# Altium project MB1292.PrjPcb (part 3 of 3)

## Sheet LEDs_Buttons.SchDoc: LEDs, touchkey and push-buttons
size A4; Date: Not used; ApprovedBy: Not used; CheckedBy: Not used; Author: Not used; CompanyName: STMicroelectronics; DrawnBy: Not used; Engineer: Not used; Organization: Not used; Address1: Not used; Address2: Not used; Address3: Not used; Address4: Not used; DocumentNumber: Not used; Revision: Not used; SheetNumber: 5; SheetTotal: 8; CurrentTime: Not used; CurrentDate: Not used; Time: Not used; DocumentFullPathAndName: Not used; DocumentName: Not used; ModifiedDate: Not used; ImagePath: Not used; ProjectName: Not used; Application_BuildNumber: Not used
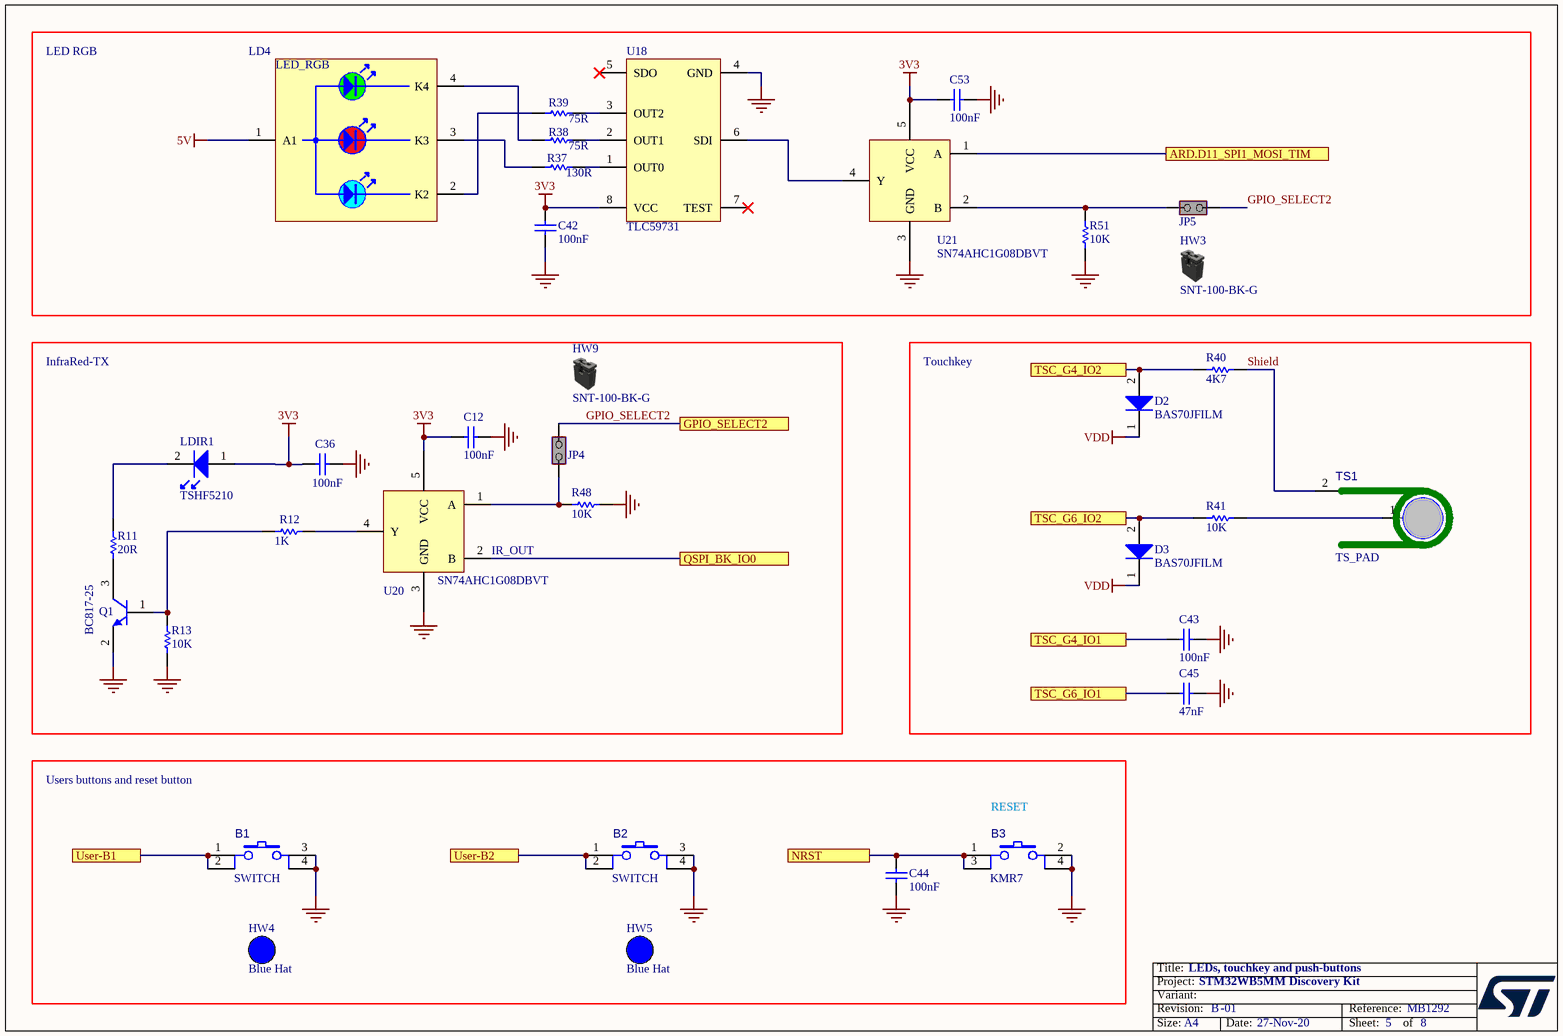
[diagram p7: LEDs_Buttons.SchDoc]

### Parts
B1  value SWITCH  [SWI_WEALTHMETAL_TD-0341_4P_BLUE]  (hidden comment: SW-PUSH-CMS)
B2  value SWITCH  [SWI_WEALTHMETAL_TD-0341_4P_BLUE]  (hidden comment: SW-PUSH-CMS)
B3  value KMR7  [SWI_C&K_KMR721NG-LFS]  (hidden comment: SW-PUSH-CMS_KMR_NG)
C12  value 100nF  [C0402]  (hidden comment: Capacitor)
C36  value 100nF  [C0402]  (hidden comment: Capacitor)
C42  value 100nF  [C0402]  (hidden comment: Capacitor)
C43  value 100nF  [C1206_H1P6]  (hidden comment: Capacitor)
C44  value 100nF  [C0402]  (hidden comment: Capacitor)
C45  value 47nF  [C0805_KEMET_IPC-7351_DENSITY-LEVEL-B_H1P25]  (hidden comment: Capacitor)
C53  value 100nF  [C0402]  (hidden comment: Capacitor)
D2  value BAS70JFILM  [DIO_SOD323_1K_2A]  (hidden comment: DIODE_1K_2A)
D3  value BAS70JFILM  [DIO_SOD323_1K_2A]  (hidden comment: DIODE_1K_2A)
HW3  value SNT-100-BK-G  (hidden comment: Shunt Black 2.54mm)  (mechanical)
HW4  value Blue Hat  (hidden comment: BUTTON_HAT_BLUE)  (mechanical)
HW5  value Blue Hat  (hidden comment: BUTTON_HAT_BLUE)  (mechanical)
HW9  value SNT-100-BK-G  (hidden comment: Shunt Black 2.54mm)  (mechanical)
JP4  Jumper_Header 2x1 Fitted  [CON_SAMTEC_TSW-102-07-G-S]  (value not drawn)
JP5  Jumper_Header 2x1 Fitted  [CON_SAMTEC_TSW-102-07-G-S]  (value not drawn)
LD4  LED_RGB  [LED_TRI-RGB_WURTH_150141M173100]
LDIR1  TSHF5210  [LED_INFRARED_VISHAY_TSHF5210_IN-MODE-SMT_BOARD-EDGE_1A2K_P254]
Q1  value BC817-25  [NPN_SOT23]  (hidden comment: 9013-SOT23)
R11  value 20R  [R0603]  (hidden comment: Resistor)
R12  value 1K  [R0402]  (hidden comment: Resistor)
R13  value 10K  [R0402]  (hidden comment: Resistor)
R37  value 130R  [R0603]  (hidden comment: Resistor)
R38  value 75R  [R0603]  (hidden comment: Resistor)
R39  value 75R  [R0603]  (hidden comment: Resistor)
R40  value 4K7  [R0603]  (hidden comment: Resistor)
R41  value 10K  [R0603]  (hidden comment: Resistor)
R48  value 10K  [R0402]  (hidden comment: Resistor)
R51  value 10K  [R0402]  (hidden comment: Resistor)
TS1  TS_PAD  [TSB_TOUCH-SENSING-BUTTON_TS-PAD-10_SHIELD-14_2]  (no BOM)
U18  TLC59731  [ICC_SOIC8_3P91X4P90_P127_H1P75]
U20  SN74AHC1G08DBVT  [ICC_SOT23-5L_H1P45]
U21  SN74AHC1G08DBVT  [ICC_SOT23-5L_H1P45]

### Blocks framed on the sheet
LED RGB: C42 C53 HW3 JP5 LD4 R37-R39 R51 U18 U21
Touchkey: C43 C45 D2 D3 R40 R41 TS1

### Ports
ARD.D11_SPI1_MOSI_TIM, GPIO_SELECT2, NRST, QSPI_BK_IO0, TSC_G4_IO1, TSC_G4_IO2, TSC_G6_IO1, TSC_G6_IO2, User-B1, User-B2

### Nets
3V3: C12.2 C36.2 C42.2 C53.2 LDIR1.1(A) U18.8(VCC) U20.5(VCC) U21.5(VCC)
5V: LD4.1(A1)
GND: B1.3 B1.4 B2.3 B2.4 B3.2 B3.4 C12.1 C36.1 C42.1 C43.1 C44.2 C45.1 C53.1 Q1.2(E) R13.1 R48.2 R51.1 U18.4(GND) U20.3(GND) U21.3(GND)
VDD: D2.1(K) D3.1(K)
ARD.D11_SPI1_MOSI_TIM: U21.1(A) ; port ARD.D11_SPI1_MOSI_TIM
GPIO_SELECT2: JP4.1(COMMON) JP5.2(NO) ; port GPIO_SELECT2
NRST: B3.1 B3.3 C44.1 ; port NRST
QSPI_BK_IO0: U20.2(B) ; port QSPI_BK_IO0
Shield: R40.2 TS1.2(SHIELD)
TSC_G4_IO1: C43.2 ; port TSC_G4_IO1
TSC_G4_IO2: D2.2(A) R40.1 ; port TSC_G4_IO2
TSC_G6_IO1: C45.2 ; port TSC_G6_IO1
TSC_G6_IO2: D3.2(A) R41.1 ; port TSC_G6_IO2
User-B1: B1.1 B1.2 ; port User-B1
User-B2: B2.1 B2.2 ; port User-B2
NetJP4_2: JP4.2(NO) R48.1 U20.1(A)
NetJP5_1: JP5.1(COMMON) R51.2 U21.2(B)
NetLD4_2: LD4.2(K2) R39.1
NetLD4_3: LD4.3(K3) R37.1
NetLD4_4: LD4.4(K4) R38.1
NetLDIR1_2: LDIR1.2(K) R11.1
NetQ1_1: Q1.1(B) R12.1 R13.2
NetQ1_3: Q1.3(C) R11.2
NetR12_2: R12.2 U20.4(Y)
NetR37_2: R37.2 U18.1(OUT0)
NetR38_2: R38.2 U18.2(OUT1)
NetR39_2: R39.2 U18.3(OUT2)
NetR41_2: R41.2 TS1.1(TKEY)
NetU18_6: U18.6(SDI) U21.4(Y)

Not connected (* = marked no-connect by the designer): U18 5(SDO)* 7(TEST)*

### Notes on the sheet
- InfraRed-TX
- (near U20) IR_OUT
- Users buttons and reset button
- (near B3) RESET
- Title:
- Project:
- Size:
- Revision:
- Variant:
- A4
- -
- Date:
- Reference:
- Sheet:
- of

### Library data of the parts
B1 B2 = MCD-00002: Non-Open Push-Button 0.1A 24V; Part_Type: Misc; Manufacturer_Part_Number: TD-0341; Manufacturer: WEALTHMETAL; Part_Preference: Recommended; Internal_Part_Number: MCD-00002; Status: Released; ComponentLink1URL: http://tunmcdsvn.tun.st.com/Component_Datasheet_Library/Trunk/Misc/Wealthmetal_Tact-Switch_TD0341
B3 = MCD-01510: Microminiature SMT Top, 2N, N.O., IP67; Part_Type: Misc; Manufacturer_Part_Number: KMR721NG LFS; Manufacturer: C&K; Part_Preference: Recommended; Internal_Part_Number: MCD-01510; Status: New; Package: KMR7; ComponentLink1URL: http://tunmcdsvn.tun.st.com/Component_Datasheet_Library/Trunk/Misc/C&K_KMR7/kmr7.pdf
C12 C36 C42 C44 C53 = MCD-00006: Capacitor, MLCC, 100nF, 16V, X7R, +/-10%, 0402, T=0.5mm; Manufacturer_Part_Number: CC0402KRX7R7BB104; Manufacturer: YAGEO; Alternate_Manufacturer_Part_Number: GCM155R71C104KA55D; Alternate_Manufacturer: MURATA; Part_Preference: Recommended; Order_Code_RS: 616-9701; Internal_Part_Number: MCD-00006; Status: Released; Part_Type: Capacitor; Package: C0402; ComponentLink1URL: http://tunmcdsvn.tun.st.com/Component_Datasheet_Library/Trunk/Capacitors/Yageo_Multilayer_Capacitor_X7R_series_100pF_to_22uF; Order_Code_Digikey: 311-1338-1-ND; Order_Code_Farnell: 9402047
C43 = MCD-02039: Capacitor, COG, 100nF, 25V , 1206, 5%; Manufacturer_Part_Number: C1206X104J3GACTU; Manufacturer: KEMET; Part_Preference: Recommended; Internal_Part_Number: MCD-02039; Status: Released; Part_Type: Capacitor; Package: C1206; ComponentLink1URL: http://tunmcdsvn.tun.st.com/Component_Datasheet_Library/Trunk/Capacitors/KEMET_Capacitor_C0G-series; Order_Code_Digikey: N/A; Order_Code_Farnell: 2760643; Order_Code_RS: N/A; Alternate_Manufacturer: N/A; Alternate_Manufacturer_Part_Number: N/A
C45 = MCD-02040: Capacitor, COG, 47nF, 25V , 0805, 5%; Manufacturer_Part_Number: C0805C473J3GACTU; Manufacturer: KEMET; Part_Preference: Recommended; Internal_Part_Number: MCD-02040; Status: Released; Part_Type: Capacitor; Package: C0805; ComponentLink1URL: http://tunmcdsvn.tun.st.com/Component_Datasheet_Library/Trunk/Capacitors/KEMET_Capacitor_C0G-series; Order_Code_Digikey: N/A; Order_Code_Farnell: 1535570; Order_Code_RS: N/A; Alternate_Manufacturer: N/A; Alternate_Manufacturer_Part_Number: N/A
D2 D3 = MCD-01880: ultrafast and RF switching diode, VF = 0.41 V @ IF = 1mA; VR = 70V;; Manufacturer: STMICROELECTRONICS; BMS_Part_Number: 9151076; Part_Preference: Recommended; Manufacturer_HQ_COO: EU; Order_Code_RS: 714-0486; Component_Country_Of_Origin: China; Internal_Part_Number: MCD-01880; Status: Released; Part_Type: Diode; Manufacturer_Part_Number: BAS70JFILM; Package: SOD-323; ComponentLink1URL: http://tunmcdsvn.tun.st.com/Component_Datasheet_Library/Trunk/Diodes/STM_SCHOTTKY_BAS70JFILM; Alternate_Manufacturer: N/A; Alternate_Manufacturer_Part_Number: N/A; Order_Code_Digikey: 497-6652-1-ND; Order_Code_Farnell: 9801413
HW3 HW9 = MCD-00043: SHUNT 2.54mm BLACK; Part_Type: Misc; Manufacturer: SAMTEC; Alternate_Manufacturer_Part_Number: 316102S111A; Alternate_Manufacturer: JIUBABA; Part_Preference: Recommended; Internal_Part_Number: MCD-00043; Status: Released; Manufacturer_Part_Number: SNT-100-BK-G; ComponentLink1URL: http://tunmcdsvn.tun.st.com/Component_Datasheet_Library/Trunk/Connectors/Samtec_Shunt_Jumper_SNT100
HW4 HW5 = MCD-02136: switch hat,blue,KTSC-62B; Part_Type: Misc; Manufacturer_Part_Number: AKTSC62B; Manufacturer: APEM; Part_Preference: Recommended; Order_Code_RS: 378-6779; Internal_Part_Number: MCD-02136; Status: Checked; Alternate_Manufacturer_Part_Number: N/A; Alternate_Manufacturer: N/A; ComponentLink1URL: http://tunmcdsvn.tun.st.com/Component_Datasheet_Library/Trunk/Mechanical/APEM_BLUEHAT_KTSC62; Order_Code_Digikey: AKTSC62B-ND; Order_Code_Farnell: N/A
JP4 JP5 = MCD-01904: Header, 2x1, 2,54mm, VR, TH, Height 5.84mm/2.54mm - Shunt Fitted by default; Part_Type: Connector; Manufacturer_Part_Number: TSW-102-07-G-S; Manufacturer: SAMTEC; Part_Preference: Recommended; Order_Code_RS: 155-7981; Internal_Part_Number: MCD-01904; Value: Header 2x1; Status: Checked; ComponentLink1URL: http://tunmcdsvn.tun.st.com/Component_Datasheet_Library/Trunk/Connectors/Samtec_TSW-HTSW-series; Alternate_Manufacturer: N/A; Alternate_Manufacturer_Part_Number: N/A; Order_Code_Digikey: SAM1029-02-ND; Order_Code_Farnell: 2505044
LD4 = MCD-02035: LED, RGB 2,8x3,2mm; Part_Type: Display; Manufacturer: WURTH ELEKTRONIK; Part_Preference: Recommended; Value: 150141M173100; Order_Code_RS: 146-0091; Order_Code_Digikey: 732-4998-2-ND; Order_Code_Farnell: N/A; Status: Released; ComponentLink1URL: http://tunmcdsvn.tun.st.com/Component_Datasheet_Library/Trunk/Display/WURTH-ELEKTRONIK_LED-RGB_150141M173100; Internal_Part_Number: MCD-02035; Manufacturer_Part_Number: 150141M173100; Package: LED 1411
LDIR1 = MCD-02137: Diode infrared, 890nm emitting, T-1 3/4, 35,5mmx2.54mm; Part_Preference: Recommended; Manufacturer: VISHAY; Order_Code_RS: 699-7663; Internal_Part_Number: MCD-02137; Value: TSHF5210; Status: Checked; Part_Type: Diode; Manufacturer_Part_Number: TSHF5210; Alternate_Manufacturer: N/A; Alternate_Manufacturer_Part_Number: N/A; Package: T-1 3/4; ComponentLink1URL: http://tunmcdsvn.tun.st.com/Component_Datasheet_Library/Trunk/Diodes/Vishay_Diode-infrared_tshf5210; Order_Code_Digikey: 751-1210-ND; Order_Code_Farnell: 1779669
Q1 = MCD-01385: Transistor Bipolar NPN, 45V, 500mA, 100MHz, 300mW, SOT23-3; Part_Type: IC; Manufacturer_Part_Number: BC817-25LT3G; Manufacturer: ON SEMICONDUCTOR; Part_Preference: Recommended; Revision: *; Internal_Part_Number: MCD-01385; Status: Released; Package: SOT23-3; ComponentLink1URL: http://tunmcdsvn.tun.st.com/Component_Datasheet_Library/Trunk/IC/ON_SEMICONDUCTOR_Transistor_BC817-25LT3G
R11 = MCD-00345: Resistor,20R,0603,1%,1/10W; Manufacturer_Part_Number: RC0603FR-0720RL; Manufacturer: YAGEO; Part_Preference: Recommended; Internal_Part_Number: MCD-00345; Status: Released; Part_Type: Resistor; Package: R0603; ComponentLink1URL: http://tunmcdsvn.tun.st.com/Component_Datasheet_Library/Trunk/Resistors/Yageo_Resistor_RC0603-series; Order_Code_Digikey: 311-20.0HRCT-ND; Order_Code_Farnell: 1799333; Order_Code_RS: N/A
R12 = MCD-00061: Resistor,1K,0402,1%,1/16W; Manufacturer_Part_Number: RC0402FR-071KL; Manufacturer: YAGEO; Part_Preference: Recommended; Internal_Part_Number: MCD-00061; Status: Released; Part_Type: Resistor; Package: R0402; ComponentLink1URL: http://tunmcdsvn.tun.st.com/Component_Datasheet_Library/Trunk/Resistors/Yageo_Resistor_RC0402-series; Order_Code_Digikey: 311-1.00KLRCT-ND; Order_Code_Farnell: 9239235; Order_Code_RS: N/A
R13 R48 R51 = MCD-00053: Resistor,10K,0402,1%,1/16W; Manufacturer_Part_Number: RC0402FR-0710KL; Manufacturer: YAGEO; BMS_Part_Number: 9131590; Part_Preference: Recommended; Internal_Part_Number: MCD-00053; Status: Released; Part_Type: Resistor; Package: R0402; ComponentLink1URL: http://tunmcdsvn.tun.st.com/Component_Datasheet_Library/Trunk/Resistors/Yageo_Resistor_RC0402-series; Order_Code_Digikey: 311-10.0KLRCT-ND; Order_Code_Farnell: 9239359; Order_Code_RS: N/A
R37 = MCD-00380: Resistor,130R,0603,1%,1/10W; Manufacturer_Part_Number: RC0603FR-07130RL; Manufacturer: YAGEO; BMS_Part_Number: 9129733; Part_Preference: Recommended; Internal_Part_Number: MCD-00380; Status: Released; Part_Type: Resistor; Package: R0603; ComponentLink1URL: http://tunmcdsvn.tun.st.com/Component_Datasheet_Library/Trunk/Resistors/Yageo_Resistor_RC0603-series; Order_Code_Digikey: 311-130HRCT-ND; Order_Code_Farnell: 1799326; Order_Code_RS: N/A
R38 R39 = MCD-00516: Resistor,75R,0603,1%,1/10W; Manufacturer_Part_Number: RC0603FR-0775RL; Manufacturer: YAGEO; BMS_Part_Number: 9129726; Part_Preference: Recommended; Internal_Part_Number: MCD-00516; Status: Released; Part_Type: Resistor; Package: R0603; ComponentLink1URL: http://tunmcdsvn.tun.st.com/Component_Datasheet_Library/Trunk/Resistors/Yageo_Resistor_RC0603-series; Order_Code_Digikey: 311-75.0HRCT-ND; Order_Code_Farnell: 1799355; Order_Code_RS: N/A
R40 = MCD-00219: Resistor,4K7,0603,1%,1/10W; Manufacturer_Part_Number: RC0603FR-074K7L; Manufacturer: YAGEO; Part_Preference: Recommended; Internal_Part_Number: MCD-00219; Status: Released; Part_Type: Resistor; Package: R0603; ComponentLink1URL: http://tunmcdsvn.tun.st.com/Component_Datasheet_Library/Trunk/Resistors/Yageo_Resistor_RC0603-series; Order_Code_Digikey: 311-4.70KHRCT-ND; Order_Code_Farnell: 9238565; Order_Code_RS: N/A
R41 = MCD-00220: Resistor,10K,0603,1%,1/10W; Manufacturer_Part_Number: RC0603FR-0710KL; Manufacturer: YAGEO; Part_Preference: Recommended; Internal_Part_Number: MCD-00220; Status: Released; Part_Type: Resistor; Package: R0603; ComponentLink1URL: http://tunmcdsvn.tun.st.com/Component_Datasheet_Library/Trunk/Resistors/Yageo_Resistor_RC0603-series; Order_Code_Digikey: 311-10.0KHRCT-ND; Order_Code_Farnell: 9238603; Order_Code_RS: N/A
TS1 = MCD-02082: -Touch Sensing button: diameter 10mm min,  active shield diameter 12mm min; Part_Type: Misc; Part_Preference: Recommended; Manufacturer_Part_Number: Touch_sensing_Button; Internal_Part_Number: MCD-02082; Value: TS_PAD; Status: Released; Manufacturer: N/A; ComponentLink1URL: http://tunmcdsvn.tun.st.com/Component_Datasheet_Library/Trunk/Misc/STM_Touch_Sensing_Button
U18 = MCD-02033: LED, driver for PWM, 4.90 mm × 3.91 mm; Part_Type: IC; Manufacturer: TEXAS INSTRUMENTS; Part_Preference: Recommended; Value: TLC59731DR; Order_Code_Digikey: 296-40590-2-ND; Order_Code_Farnell: 3119199; Order_Code_RS: N/A; Status: Released; ComponentLink1URL: http://tunmcdsvn.tun.st.com/Component_Datasheet_Library/Trunk/IC/TI_3-channel_Led-Driver; Internal_Part_Number: MCD-02033; Manufacturer_Part_Number: TLC59731; Alternate_Manufacturer_Part_Number: N/A; Alternate_Manufacturer: N/A; Package: SOIC
U20 U21 = MCD-02053: Logic AND Gate, 2.90 mm × 1.60 mm; Part_Type: IC; Manufacturer: TEXAS INSTRUMENTS; Part_Preference: Recommended; Order_Code_RS: 6627709; Value: SN74AHC1G08DBVT; Order_Code_Digikey: N/A; Order_Code_Farnell: N/A; Status: Released; ComponentLink1URL: http://tunmcdsvn.tun.st.com/Component_Datasheet_Library/Trunk/IC/TI_Logic-AND-Gate_SN74AHC1G08DBVT; Internal_Part_Number: MCD-02053; Manufacturer_Part_Number: SN74AHC1G08DBVT; Alternate_Manufacturer_Part_Number: N/A; Alternate_Manufacturer: N/A; Package: SOT-23

## Nets that join several sheets
3V3: Connectors (6 pins), MEMS (29 pins), MCU_Display (C49.1 U19.8), Power_management (5 pins), LEDs_Buttons (8 pins)
3V3_STLK: ST-LINK_V2-1 (16 pins), Power_management (C27.2 C28.2 U13.5)
3V6_LDO: MCU_Display (C50.1 U19.5), Power_management (C24.2 U12.5)
5V: ST-LINK_V2-1 (D1.1), Connectors (CN2.5 CN5.6 CN5.15), Power_management (12 pins), LEDs_Buttons (LD4.1)
5V_INT: Connectors (R1.2), Power_management (5 pins)
5V_USB_MCU: Connectors (C2.1 CN6.1 U3.1), Power_management (D5.1 JP2.4)
5V_USB_STLK: ST-LINK_V2-1 (C41.1 CN11.1 R50.2 U16.1), Power_management (6 pins)
AVDD: Connectors (CN1.8), Power_management (5 pins)
GND: ST-LINK_V2-1 (35 pins), Connectors (26 pins), MEMS (20 pins), MCU_Display (15 pins), Power_management (35 pins), LEDs_Buttons (20 pins)
VDD: ST-LINK_V2-1 (R26.1), Connectors (CN13.2), Power_management (5 pins), LEDs_Buttons (D2.1 D3.1)
VIN: Connectors (CN2.8), Power_management (C13.1 C15.2 SB1.2 U9.3)
ARD.D2_IO: Connectors (CN4.3), MCU_Display (U1.66)
ARD.D3_TIM: Connectors (CN4.4), MCU_Display (U1.63)
ARD.D4_IO: Connectors (CN4.5), MCU_Display (U1.42)
ARD.D5_TIM: Connectors (CN4.6), MCU_Display (C55.2 U1.47)
ARD.D6_TIM: Connectors (CN4.7), MCU_Display (U1.79)
ARD.D7: Connectors (CN4.8), MCU_Display (U1.48)
ARD.D8: Connectors (CN1.1), MCU_Display (U1.65)
ARD.D9_TIM: Connectors (CN1.2), MCU_Display (U1.76)
ARD.D10_SPI1_NSS_TIM: Connectors (CN1.3), MCU_Display (U1.55)
ARD.D11_SPI1_MOSI_TIM: Connectors (CN1.4), MCU_Display (U1.52 U19.15), LEDs_Buttons (U21.1)
ARD.D12_SPI1_MISO: Connectors (CN1.5), MCU_Display (U1.20)
ARD.D13_SPI1_SCK: Connectors (CN1.6), MCU_Display (U1.2 U19.14)
ARD_ADC.ADC1_IN4: Connectors (CN3.1), MCU_Display (U1.7)
ARD_ADC.ADC1_IN7: Connectors (CN3.2), MCU_Display (U1.1)
ARD_ADC.ADC1_IN13: Connectors (CN3.5), MCU_Display (U1.49)
ARD_ADC.ADC1_IN14: Connectors (CN3.6), MCU_Display (C54.1 U1.45)
BOOT0: Connectors (CN13.1 R54.2), MCU_Display (U1.13)
COM.ADC1_IN2: Connectors (CN3.4 CN5.20), MCU_Display (U1.9)
COM.ADC1_IN10: Connectors (CN3.3 CN5.19 CN15.1), MCU_Display (U1.54)
COM.I2C1_SCL: Connectors (CN1.10 CN5.7 R24.1), MCU_Display (U1.14)
COM.I2C1_SDA: Connectors (CN1.9 CN5.10 R44.1), MCU_Display (U1.28)
DRDY: MEMS (U4.2), MCU_Display (U1.64)
GPIO_SELECT1: Connectors (R6.1 U2.9), MCU_Display (U1.78)
GPIO_SELECT2: MCU_Display (U1.62), LEDs_Buttons (JP4.1 JP5.2)
I2C3_SCL: MEMS (R45.1 U4.1 U5.13 U6.10), MCU_Display (U1.35)
I2C3_SDA: MEMS (R46.1 U4.6 U5.14 U6.9), MCU_Display (C56.2 U1.46)
INT1: MEMS (U5.4), MCU_Display (U1.68)
INT2: MEMS (R47.1 U6.7), MCU_Display (U1.74)
LPUART1_RX_MCU: Connectors (U2.7), MCU_Display (U1.12)
LPUART1_TX_MCU: Connectors (U2.8), MCU_Display (U1.19)
NRST: ST-LINK_V2-1 (R55.2 U15.18), Connectors (CN2.3), MCU_Display (U1.10), LEDs_Buttons (B3.1 B3.3 C44.1)
PWR_ENn: ST-LINK_V2-1 (U15.28), Power_management (R15.1 U11.4)
QSPI_BK_IO0: MEMS (U8.15), MCU_Display (U1.11), LEDs_Buttons (U20.2)
QSPI_BK_IO1: MEMS (U8.8), MCU_Display (U1.80)
QSPI_BK_IO2: MEMS (U8.9), MCU_Display (U1.81)
QSPI_BK_IO3: MEMS (U8.1), MCU_Display (U1.67)
QSPI_BK_NCS: MEMS (R49.1 U8.7), MCU_Display (U1.70)
QSPI_BK_SCK: MEMS (U8.16), MCU_Display (U1.56)
SAI1_CK2: Connectors (CN12.1), MEMS (U7.3), MCU_Display (U1.50)
SAI1_DI2: Connectors (CN14.1), MEMS (U7.4), MCU_Display (U1.51)
STMOD+.ADC1_IN5: Connectors (CN5.13), MCU_Display (U1.3)
STMOD+.GPIO1: Connectors (CN5.17), MCU_Display (U1.23)
STMOD+.GPIO2: Connectors (CN5.18), MCU_Display (U1.22)
STMOD+.INT: Connectors (CN5.11), MCU_Display (U1.72)
STMOD+.LPUART1_CTS: Connectors (R2.1), MCU_Display (U1.53)
STMOD+.LPUART1_RTS: Connectors (R5.1), MCU_Display (U1.41)
STMOD+.RST: Connectors (CN5.12), MCU_Display (U1.75)
STMOD+.SPI2_MISO: Connectors (CN5.3 R4.2), MCU_Display (U1.8)
STMOD+.SPI2_MISO2: Connectors (CN5.9), MCU_Display (U1.37)
STMOD+.SPI2_MOSI: Connectors (CN5.2 R3.2), MCU_Display (U1.73)
STMOD+.SPI2_MOSI2: Connectors (CN5.8), MCU_Display (U1.38)
STMOD+.SPI2_NSS: Connectors (CN5.1 R2.2), MCU_Display (U1.33)
STMOD+.SPI2_SCK: Connectors (CN5.4 R5.2), MCU_Display (U1.34)
STMOD+.TIM2_CH1: Connectors (CN5.14), MCU_Display (U1.27)
T_SWCLK: ST-LINK_V2-1 (R56.2 U15.15 U15.26), MCU_Display (U1.26)
T_SWDIO: ST-LINK_V2-1 (R25.1 R58.2 U15.27), MCU_Display (U1.25)
T_SWO: ST-LINK_V2-1 (R57.1 U15.31), MCU_Display (U1.21)
TSC_G4_IO1: MCU_Display (U1.36), LEDs_Buttons (C43.2)
TSC_G4_IO2: MCU_Display (U1.71), LEDs_Buttons (D2.2 R40.1)
TSC_G6_IO1: MCU_Display (U1.77), LEDs_Buttons (C45.2)
TSC_G6_IO2: MCU_Display (U1.82), LEDs_Buttons (D3.2 R41.1)
USB_N: Connectors (U14.2), MCU_Display (U1.30)
USB_P: Connectors (U14.1), MCU_Display (U1.29)
User-B1: MCU_Display (U1.24), LEDs_Buttons (B1.1 B1.2)
User-B2: MCU_Display (U1.40), LEDs_Buttons (B2.1 B2.2)
VCP_RX: ST-LINK_V2-1 (R28.2), MCU_Display (U1.18)
VCP_TX: ST-LINK_V2-1 (R29.1), MCU_Display (U1.39)

## Assembly variants
WB5MM: not fitted CN7 CN8 CN9 CN10 CN12 CN13 CN14 CN15 R20 R22 R30 SB1 SB3 SB4 SB5 SB10 SB10 SB12